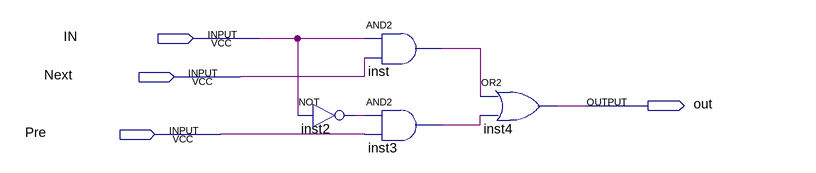
[diagram p0: schematic sheet]
// Quartus schematic select.bdf as structural Verilog: 4 symbols, 4 pins
module select (
  input  IN,
  input  Next,
  input  Pre,
  output out
);

  wire inst2_out, inst3_out, inst_out;

  not inst2 (inst2_out, IN);
  and inst (inst_out, IN, Next);
  and inst3 (inst3_out, inst2_out, Pre);
  or inst4 (out, inst_out, inst3_out);
endmodule
